# EAGLE schematic bms1ry (EAGLE 4.13)
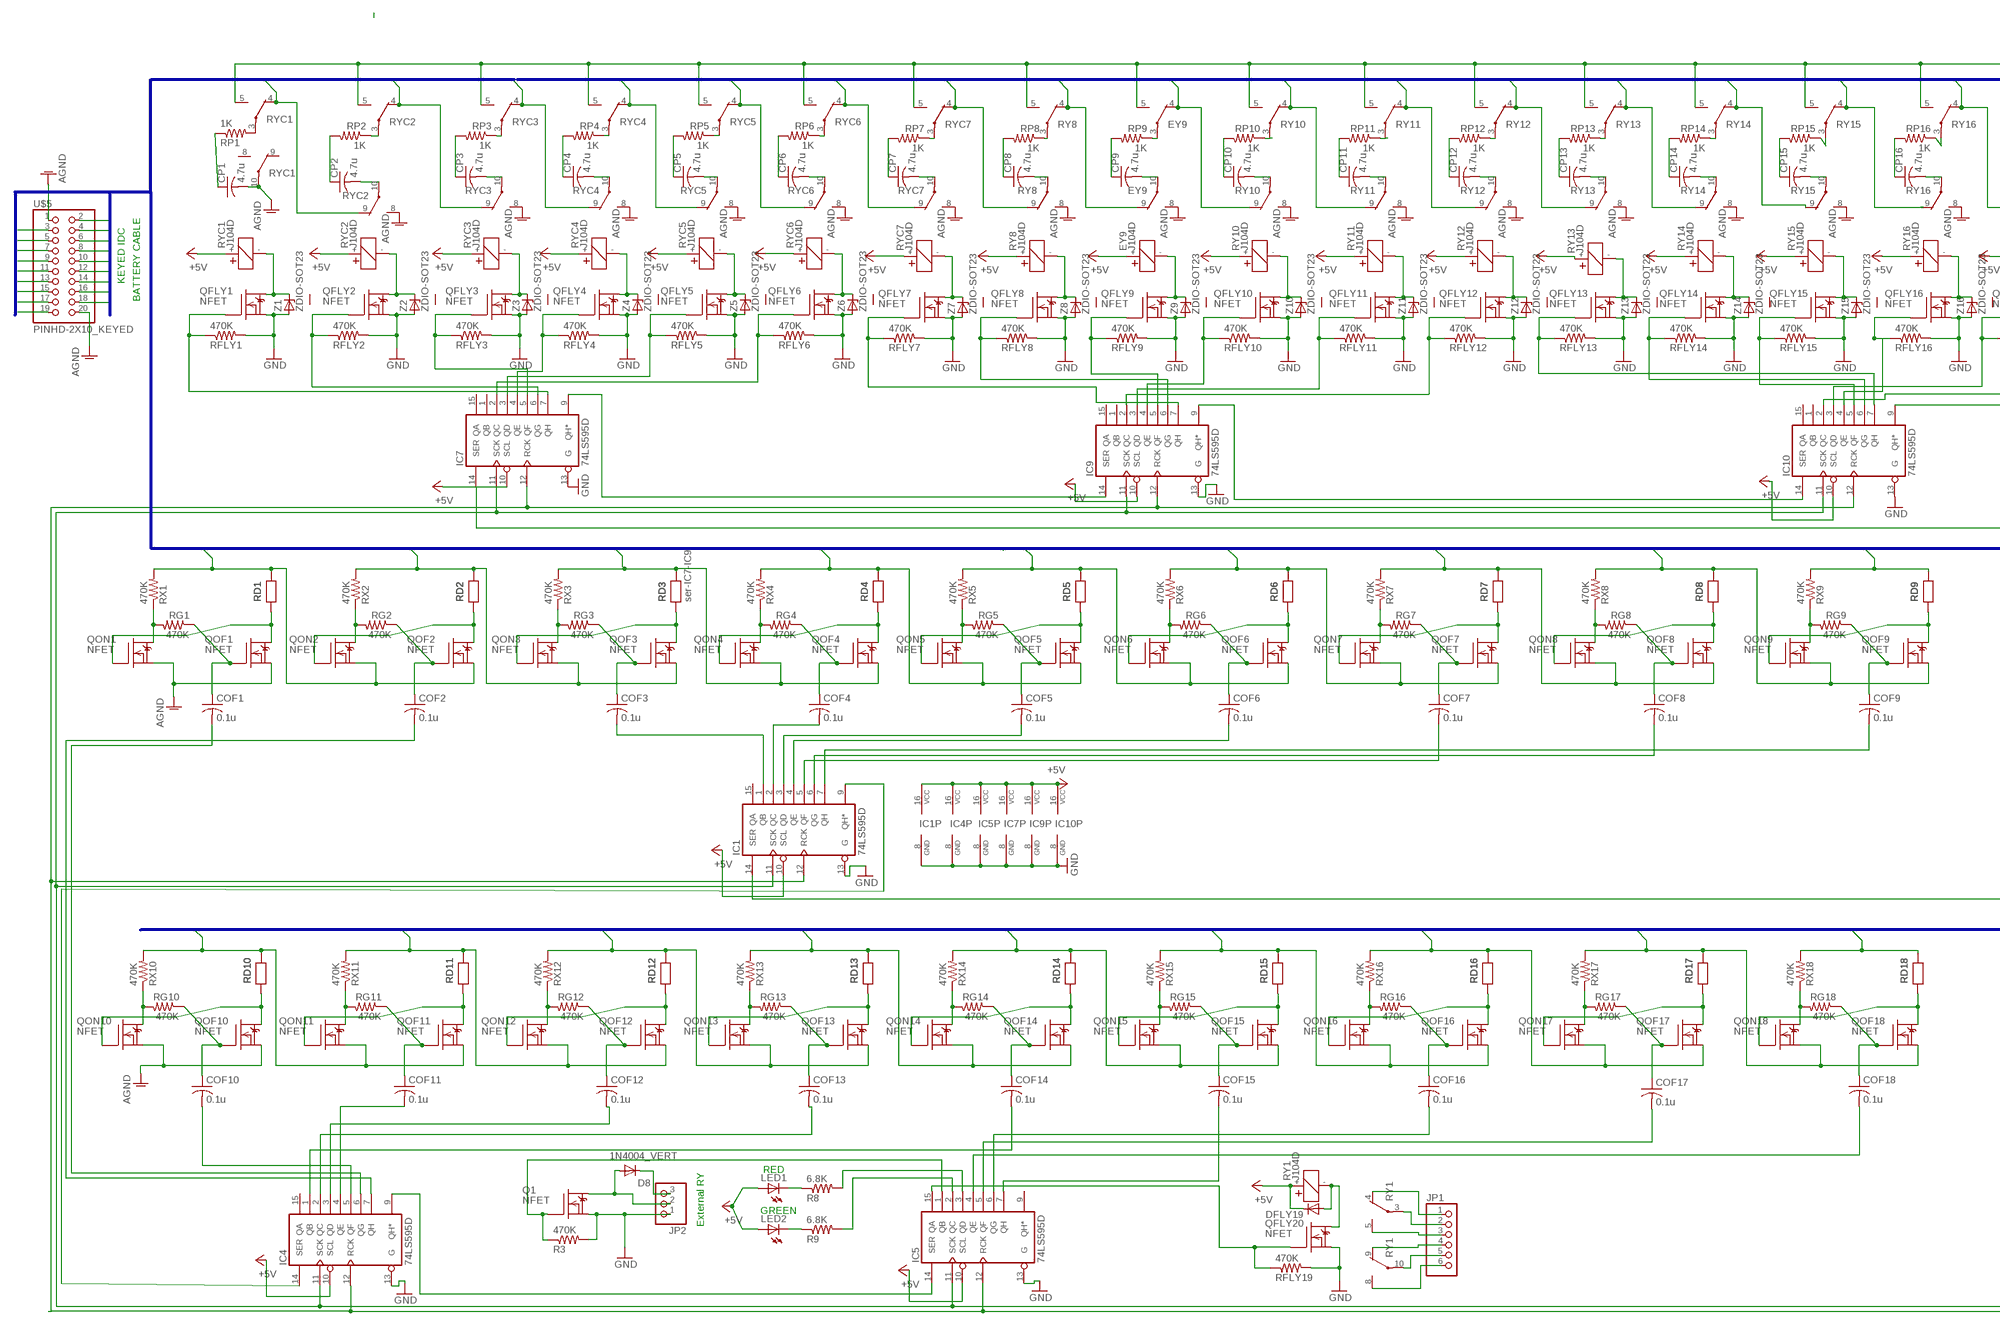
[diagram p0: schematic, sheet 1, part 1 of 2]
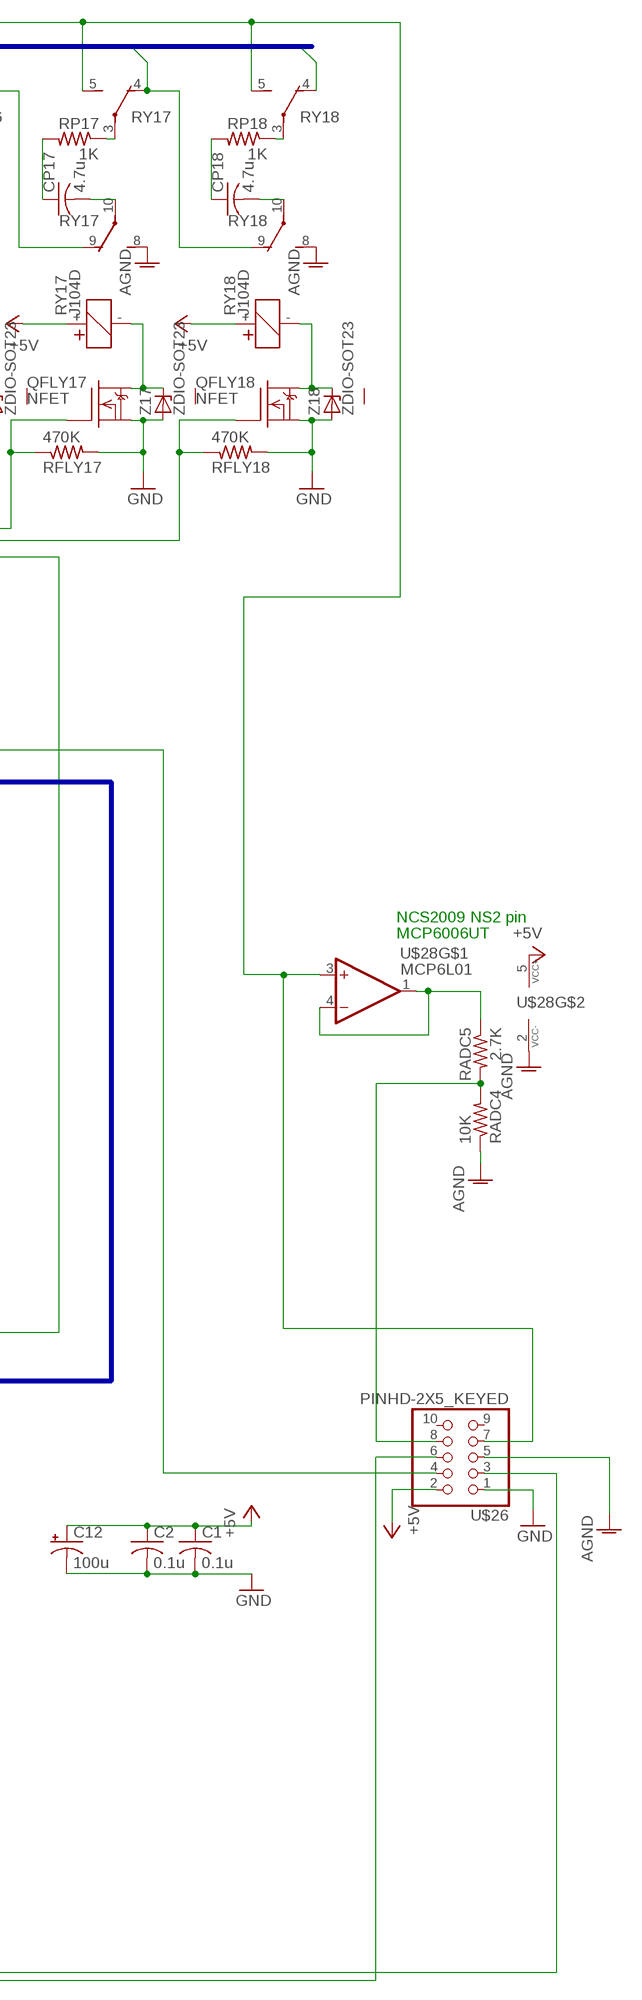
[diagram p1: schematic, sheet 1, part 2 of 2]

## Parts
C1  0.1u  C-USC0603  [C0603]
C2  0.1u  C-USC0603  [C0603]
C12  100u  CPOL-USE5-8.5  [E5-8,5]
COF1  0.1u  C-USC0603  [C0603]
COF2  0.1u  C-USC0603  [C0603]
COF3  0.1u  C-USC0603  [C0603]
COF4  0.1u  C-USC0603  [C0603]
COF5  0.1u  C-USC0603  [C0603]
COF6  0.1u  C-USC0603  [C0603]
COF7  0.1u  C-USC0603  [C0603]
COF8  0.1u  C-USC0603  [C0603]
COF9  0.1u  C-USC0603  [C0603]
COF10  0.1u  C-USC0603  [C0603]
COF11  0.1u  C-USC0603  [C0603]
COF12  0.1u  C-USC0603  [C0603]
COF13  0.1u  C-USC0603  [C0603]
COF14  0.1u  C-USC0603  [C0603]
COF15  0.1u  C-USC0603  [C0603]
COF16  0.1u  C-USC0603  [C0603]
COF17  0.1u  C-USC0603  [C0603]
COF18  0.1u  C-USC0603  [C0603]
CP1  4.7u  C-USC0805  [C0805]
CP2  4.7u  C-USC0805  [C0805]
CP3  4.7u  C-USC0805  [C0805]
CP4  4.7u  C-USC0805  [C0805]
CP5  4.7u  C-USC0805  [C0805]
CP6  4.7u  C-USC0805  [C0805]
CP7  4.7u  C-USC0805  [C0805]
CP8  4.7u  C-USC0805  [C0805]
CP9  4.7u  C-USC0805  [C0805]
CP10  4.7u  C-USC0805  [C0805]
CP11  4.7u  C-USC0805  [C0805]
CP12  4.7u  C-USC0805  [C0805]
CP13  4.7u  C-USC0805  [C0805]
CP14  4.7u  C-USC0805  [C0805]
CP15  4.7u  C-USC0805  [C0805]
CP16  4.7u  C-USC0805  [C0805]
CP17  4.7u  C-USC0805  [C0805]
CP18  4.7u  C-USC0805  [C0805]
D8  1N4004_VERT  [DO41-10_VERT]
DFLY19  DIODE-SOD80C  [SOD80C]
EY9  J104D  [J104D]
IC1  74LS595D  [SO16]
IC4  74LS595D  [SO16]
IC5  74LS595D  [SO16]
IC7  74LS595D  [SO16]
IC9  74LS595D  [SO16]
IC10  74LS595D  [SO16]
JP1  PINHD-1X6  [1X06]
JP2  PINHD-1X3  [1X03]
LED1  LEDCHIP-LED0603  [CHIP-LED0603]
LED2  LEDCHIP-LED0603  [CHIP-LED0603]
Q1  NFET  DMN3404L  [SOT-23]
QFLY1  NFET  DMN3404L  [SOT-23]
QFLY2  NFET  DMN3404L  [SOT-23]
QFLY3  NFET  DMN3404L  [SOT-23]
QFLY4  NFET  DMN3404L  [SOT-23]
QFLY5  NFET  DMN3404L  [SOT-23]
QFLY6  NFET  DMN3404L  [SOT-23]
QFLY7  NFET  DMN3404L  [SOT-23]
QFLY8  NFET  DMN3404L  [SOT-23]
QFLY9  NFET  DMN3404L  [SOT-23]
QFLY10  NFET  DMN3404L  [SOT-23]
QFLY11  NFET  DMN3404L  [SOT-23]
QFLY12  NFET  DMN3404L  [SOT-23]
QFLY13  NFET  DMN3404L  [SOT-23]
QFLY14  NFET  DMN3404L  [SOT-23]
QFLY15  NFET  DMN3404L  [SOT-23]
QFLY16  NFET  DMN3404L  [SOT-23]
QFLY17  NFET  DMN3404L  [SOT-23]
QFLY18  NFET  DMN3404L  [SOT-23]
QFLY20  NFET  DMN3404L  [SOT-23]
QOF1  NFET  DMN3404L  [SOT-23]
QOF2  NFET  DMN3404L  [SOT-23]
QOF3  NFET  DMN3404L  [SOT-23]
QOF4  NFET  DMN3404L  [SOT-23]
QOF5  NFET  DMN3404L  [SOT-23]
QOF6  NFET  DMN3404L  [SOT-23]
QOF7  NFET  DMN3404L  [SOT-23]
QOF8  NFET  DMN3404L  [SOT-23]
QOF9  NFET  DMN3404L  [SOT-23]
QOF10  NFET  DMN3404L  [SOT-23]
QOF11  NFET  DMN3404L  [SOT-23]
QOF12  NFET  DMN3404L  [SOT-23]
QOF13  NFET  DMN3404L  [SOT-23]
QOF14  NFET  DMN3404L  [SOT-23]
QOF15  NFET  DMN3404L  [SOT-23]
QOF16  NFET  DMN3404L  [SOT-23]
QOF17  NFET  DMN3404L  [SOT-23]
QOF18  NFET  DMN3404L  [SOT-23]
QON1  NFET  DMN3404L  [SOT-23]
QON2  NFET  DMN3404L  [SOT-23]
QON3  NFET  DMN3404L  [SOT-23]
QON4  NFET  DMN3404L  [SOT-23]
QON5  NFET  DMN3404L  [SOT-23]
QON6  NFET  DMN3404L  [SOT-23]
QON7  NFET  DMN3404L  [SOT-23]
QON8  NFET  DMN3404L  [SOT-23]
QON9  NFET  DMN3404L  [SOT-23]
QON10  NFET  DMN3404L  [SOT-23]
QON11  NFET  DMN3404L  [SOT-23]
QON12  NFET  DMN3404L  [SOT-23]
QON13  NFET  DMN3404L  [SOT-23]
QON14  NFET  DMN3404L  [SOT-23]
QON15  NFET  DMN3404L  [SOT-23]
QON16  NFET  DMN3404L  [SOT-23]
QON17  NFET  DMN3404L  [SOT-23]
QON18  NFET  DMN3404L  [SOT-23]
R3  470K  R-US_R0603  [R0603]
R8  6.8K  R-US_R0603  [R0603]
R9  6.8K  R-US_R0603  [R0603]
RADC4  10K  R-US_R0603  [R0603]
RADC5  2.7K  R-US_R0603  [R0603]
RD1  RESEU-S2,5  [RS-2,5]
RD2  RESEU-S2,5  [RS-2,5]
RD3  ser-IC7-IC9  RESEU-S2,5  [RS-2,5]
RD4  RESEU-S2,5  [RS-2,5]
RD5  RESEU-S2,5  [RS-2,5]
RD6  RESEU-S2,5  [RS-2,5]
RD7  RESEU-S2,5  [RS-2,5]
RD8  RESEU-S2,5  [RS-2,5]
RD9  RESEU-S2,5  [RS-2,5]
RD10  RESEU-S2,5  [RS-2,5]
RD11  RESEU-S2,5  [RS-2,5]
RD12  RESEU-S2,5  [RS-2,5]
RD13  RESEU-S2,5  [RS-2,5]
RD14  RESEU-S2,5  [RS-2,5]
RD15  RESEU-S2,5  [RS-2,5]
RD16  RESEU-S2,5  [RS-2,5]
RD17  RESEU-S2,5  [RS-2,5]
RD18  RESEU-S2,5  [RS-2,5]
RFLY1  470K  R-US_R0603  [R0603]
RFLY2  470K  R-US_R0603  [R0603]
RFLY3  470K  R-US_R0603  [R0603]
RFLY4  470K  R-US_R0603  [R0603]
RFLY5  470K  R-US_R0603  [R0603]
RFLY6  470K  R-US_R0603  [R0603]
RFLY7  470K  R-US_R0603  [R0603]
RFLY8  470K  R-US_R0603  [R0603]
RFLY9  470K  R-US_R0603  [R0603]
RFLY10  470K  R-US_R0603  [R0603]
RFLY11  470K  R-US_R0603  [R0603]
RFLY12  470K  R-US_R0603  [R0603]
RFLY13  470K  R-US_R0603  [R0603]
RFLY14  470K  R-US_R0603  [R0603]
RFLY15  470K  R-US_R0603  [R0603]
RFLY16  470K  R-US_R0603  [R0603]
RFLY17  470K  R-US_R0603  [R0603]
RFLY18  470K  R-US_R0603  [R0603]
RFLY19  470K  R-US_R0603  [R0603]
RG1  470K  R-US_R0603  [R0603]
RG2  470K  R-US_R0603  [R0603]
RG3  470K  R-US_R0603  [R0603]
RG4  470K  R-US_R0603  [R0603]
RG5  470K  R-US_R0603  [R0603]
RG6  470K  R-US_R0603  [R0603]
RG7  470K  R-US_R0603  [R0603]
RG8  470K  R-US_R0603  [R0603]
RG9  470K  R-US_R0603  [R0603]
RG10  470K  R-US_R0603  [R0603]
RG11  470K  R-US_R0603  [R0603]
RG12  470K  R-US_R0603  [R0603]
RG13  470K  R-US_R0603  [R0603]
RG14  470K  R-US_R0603  [R0603]
RG15  470K  R-US_R0603  [R0603]
RG16  470K  R-US_R0603  [R0603]
RG17  470K  R-US_R0603  [R0603]
RG18  470K  R-US_R0603  [R0603]
RP1  1K  R-US_R0603  [R0603]
RP2  1K  R-US_R0603  [R0603]
RP3  1K  R-US_R0603  [R0603]
RP4  1K  R-US_R0603  [R0603]
RP5  1K  R-US_R0603  [R0603]
RP6  1K  R-US_R0603  [R0603]
RP7  1K  R-US_R0603  [R0603]
RP8  1K  R-US_R0603  [R0603]
RP9  1K  R-US_R0603  [R0603]
RP10  1K  R-US_R0603  [R0603]
RP11  1K  R-US_R0603  [R0603]
RP12  1K  R-US_R0603  [R0603]
RP13  1K  R-US_R0603  [R0603]
RP14  1K  R-US_R0603  [R0603]
RP15  1K  R-US_R0603  [R0603]
RP16  1K  R-US_R0603  [R0603]
RP17  1K  R-US_R0603  [R0603]
RP18  1K  R-US_R0603  [R0603]
RX1  470K  R-US_R0603  [R0603]
RX2  470K  R-US_R0603  [R0603]
RX3  470K  R-US_R0603  [R0603]
RX4  470K  R-US_R0603  [R0603]
RX5  470K  R-US_R0603  [R0603]
RX6  470K  R-US_R0603  [R0603]
RX7  470K  R-US_R0603  [R0603]
RX8  470K  R-US_R0603  [R0603]
RX9  470K  R-US_R0603  [R0603]
RX10  470K  R-US_R0603  [R0603]
RX11  470K  R-US_R0603  [R0603]
RX12  470K  R-US_R0603  [R0603]
RX13  470K  R-US_R0603  [R0603]
RX14  470K  R-US_R0603  [R0603]
RX15  470K  R-US_R0603  [R0603]
RX16  470K  R-US_R0603  [R0603]
RX17  470K  R-US_R0603  [R0603]
RX18  470K  R-US_R0603  [R0603]
RY1  J104D  [J104D]
RY8  J104D  [J104D]
RY10  J104D  [J104D]
RY11  J104D  [J104D]
RY12  J104D  [J104D]
RY13  J104D  [J104D]
RY14  J104D  [J104D]
RY15  J104D  [J104D]
RY16  J104D  [J104D]
RY17  J104D  [J104D]
RY18  J104D  [J104D]
RYC1  J104D  [J104D]
RYC2  J104D  [J104D]
RYC3  J104D  [J104D]
RYC4  J104D  [J104D]
RYC5  J104D  [J104D]
RYC6  J104D  [J104D]
RYC7  J104D  [J104D]
U$5  PINHD-2X10_KEYED  [2X10_KEYED]
U$26  PINHD-2X5_KEYED  [2X05_KEYED]
U$28  MCP6L01  [SOT23-5]
Z1  ZDIO-SOT23  [SOT-23]
Z2  ZDIO-SOT23  [SOT-23]
Z3  ZDIO-SOT23  [SOT-23]
Z4  ZDIO-SOT23  [SOT-23]
Z5  ZDIO-SOT23  [SOT-23]
Z6  ZDIO-SOT23  [SOT-23]
Z7  ZDIO-SOT23  [SOT-23]
Z8  ZDIO-SOT23  [SOT-23]
Z9  ZDIO-SOT23  [SOT-23]
Z10  ZDIO-SOT23  [SOT-23]
Z11  ZDIO-SOT23  [SOT-23]
Z12  ZDIO-SOT23  [SOT-23]
Z13  ZDIO-SOT23  [SOT-23]
Z14  ZDIO-SOT23  [SOT-23]
Z15  ZDIO-SOT23  [SOT-23]
Z16  ZDIO-SOT23  [SOT-23]
Z17  ZDIO-SOT23  [SOT-23]
Z18  ZDIO-SOT23  [SOT-23]

## Nets
+5V: C1.1 C2.1 C12.+ DFLY19.C EY9.+ IC1.10(SCL) IC1.16(VCC) IC4.10(SCL) IC4.16(VCC) IC5.10(SCL) IC5.16(VCC) IC7.10(SCL) IC7.16(VCC) IC9.10(SCL) IC9.16(VCC) IC10.10(SCL) IC10.16(VCC) LED1.A LED2.A RY1.+ RY8.+ RY10.+ RY11.+ RY12.+ RY13.+ RY14.+ RY15.+ RY16.+ RY17.+ RY18.+ RYC1.+ RYC2.+ RYC3.+ RYC4.+ RYC5.+ RYC6.+ RYC7.+ U$26.2 U$28.5(VCC+)
AGND: CP1.2 EY9.8(S) QOF1.2(S) QOF10.2(S) QON1.2(S) QON10.2(S) RADC4.1 RY8.8(S) RY10.8(S) RY11.8(S) RY12.8(S) RY13.8(S) RY14.8(S) RY15.8(S) RY16.8(S) RY17.8(S) RY18.8(S) RYC1.10(P) RYC2.8(S) RYC3.8(S) RYC4.8(S) RYC5.8(S) RYC6.8(S) RYC7.8(S) U$5.1 U$5.20 U$26.5 U$28.2(VCC-)
C1: QOF2.2(S) QON2.2(S) RD1.2 RX1.2 RYC1.4(O) RYC2.9(O) U$5.11
C2: QOF3.2(S) QON3.2(S) RD2.2 RX2.2 RYC2.4(O) RYC3.9(O) U$5.2
C3: QOF4.2(S) QON4.2(S) RD3.2 RX3.2 RYC3.4(O) RYC4.9(O) U$5.12
C4: QOF5.2(S) QON5.2(S) RD4.2 RX4.2 RYC4.4(O) RYC5.9(O) U$5.3
C5: QOF6.2(S) QON6.2(S) RD5.2 RX5.2 RYC5.4(O) RYC6.9(O) U$5.13
C6: QOF7.2(S) QON7.2(S) RD6.2 RX6.2 RYC6.4(O) RYC7.9(O) U$5.4
C7: QOF8.2(S) QON8.2(S) RD7.2 RX7.2 RY8.9(O) RYC7.4(O) U$5.14
C8: EY9.9(O) QOF9.2(S) QON9.2(S) RD8.2 RX8.2 RY8.4(O) U$5.5
C9: EY9.4(O) RD9.2 RX9.2 RY10.9(O) U$5.15
C10: QOF11.2(S) QON11.2(S) RD10.2 RX10.2 RY10.4(O) RY11.9(O) U$5.6
C11: QOF12.2(S) QON12.2(S) RD11.2 RX11.2 RY11.4(O) RY12.9(O) U$5.16
C12: QOF13.2(S) QON13.2(S) RD12.2 RX12.2 RY12.4(O) RY13.9(O) U$5.7
C13: QOF14.2(S) QON14.2(S) RD13.2 RX13.2 RY13.4(O) RY14.9(O) U$5.17
C14: QOF15.2(S) QON15.2(S) RD14.2 RX14.2 RY14.4(O) RY15.9(O) U$5.8
C15: QOF16.2(S) QON16.2(S) RD15.2 RX15.2 RY15.4(O) RY16.9(O) U$5.18
C16: QOF17.2(S) QON17.2(S) RD16.2 RX16.2 RY16.4(O) RY17.9(O) U$5.9
C17: QOF18.2(S) QON18.2(S) RD17.2 RX17.2 RY17.4(O) RY18.9(O) U$5.19
C18: RD18.2 RX18.2 RY18.4(O) U$5.10
FLYCAP-COMMON: EY9.5(S) RY8.5(S) RY10.5(S) RY11.5(S) RY12.5(S) RY13.5(S) RY14.5(S) RY15.5(S) RY16.5(S) RY17.5(S) RY18.5(S) RYC1.5(S) RYC2.5(S) RYC3.5(S) RYC4.5(S) RYC5.5(S) RYC6.5(S) RYC7.5(S) U$26.7 U$28.3(+IN)
FLYCAP-OPAMP-OUT: RADC4.2 RADC5.2 U$26.8
GND: C1.2 C2.2 C12.- IC1.8(GND) IC1.13(G) IC4.8(GND) IC4.13(G) IC5.8(GND) IC5.13(G) IC7.8(GND) IC7.13(G) IC9.8(GND) IC9.13(G) IC10.8(GND) IC10.13(G) JP2.1 Q1.2(S) QFLY1.2(S) QFLY2.2(S) QFLY3.2(S) QFLY4.2(S) QFLY5.2(S) QFLY6.2(S) QFLY7.2(S) QFLY8.2(S) QFLY9.2(S) QFLY10.2(S) QFLY11.2(S) QFLY12.2(S) QFLY13.2(S) QFLY14.2(S) QFLY15.2(S) QFLY16.2(S) QFLY17.2(S) QFLY18.2(S) QFLY20.2(S) R3.2 RFLY1.2 RFLY2.2 RFLY3.2 RFLY4.2 RFLY5.2 RFLY6.2 RFLY7.2 RFLY8.2 RFLY9.2 RFLY10.2 RFLY11.2 RFLY12.2 RFLY13.2 RFLY14.2 RFLY15.2 RFLY16.2 RFLY17.2 RFLY18.2 RFLY19.2 U$26.1 Z1.1(A) Z2.1(A) Z3.1(A) Z4.1(A) Z5.1(A) Z6.1(A) Z7.1(A) Z8.1(A) Z9.1(A) Z10.1(A) Z11.1(A) Z12.1(A) Z13.1(A) Z14.1(A) Z15.1(A) Z16.1(A) Z17.1(A) Z18.1(A)
MOSI-FROM-PROC: IC7.14(SER) U$26.4
N$2: IC7.6(QG) QFLY2.1(G) RFLY2.1
N$3: RP2.1 RYC2.3(P)
N$4: D8.A JP2.2 Q1.3(D)
N$5: D8.C JP2.3
N$6: IC5.15(QA) QFLY20.1(G) RFLY19.1
N$7: LED2.C R9.1
N$8: CP15.2 RY15.10(P)
N$9: CP2.2 RYC2.10(P)
N$10: LED1.C R8.1
N$11: IC7.5(QF) QFLY3.1(G) RFLY3.1
N$12: IC7.7(QH) QFLY1.1(G) RFLY1.1
N$13: IC7.4(QE) QFLY4.1(G) RFLY4.1
N$14: IC7.3(QD) QFLY5.1(G) RFLY5.1
N$16: IC7.2(QC) QFLY6.1(G) RFLY6.1
N$17: RADC5.1 U$28.1(OUT) U$28.4(-IN)
N$18: COF3.2 IC1.1(QB)
N$19: IC9.6(QG) QFLY8.1(G) RFLY8.1
N$20: COF4.2 IC1.2(QC)
N$21: COF5.2 IC1.3(QD)
N$22: IC9.2(QC) QFLY12.1(G) RFLY12.1
N$23: IC10.7(QH) QFLY13.1(G) RFLY13.1
N$24: IC10.6(QG) QFLY14.1(G) RFLY14.1
N$25: IC10.5(QF) QFLY15.1(G) RFLY15.1
N$26: IC10.4(QE) QFLY16.1(G) RFLY16.1
N$27: IC10.3(QD) QFLY17.1(G) RFLY17.1
N$28: IC10.2(QC) QFLY18.1(G) RFLY18.1
N$29: RP3.1 RYC3.3(P)
N$30: CP4.2 RYC4.10(P)
N$31: RP1.2 RYC1.3(P)
N$32: COF6.2 IC1.4(QE)
N$33: CP2.1 RP2.2
N$34: CP3.2 RYC3.10(P)
N$35: CP5.2 RYC5.10(P)
N$36: CP6.2 RYC6.10(P)
N$38: CP7.2 RYC7.10(P)
N$39: CP8.2 RY8.10(P)
N$40: CP10.2 RY10.10(P)
N$41: CP11.2 RY11.10(P)
N$42: CP12.2 RY12.10(P)
N$43: CP13.2 RY13.10(P)
N$44: CP14.2 RY14.10(P)
N$45: CP16.2 RY16.10(P)
N$46: CP17.2 RY17.10(P)
N$47: CP15.1 RP15.2
N$48: CP18.2 RY18.10(P)
N$49: RP4.1 RYC4.3(P)
N$50: RP5.1 RYC5.3(P)
N$51: RP6.1 RYC6.3(P)
N$52: RP7.1 RYC7.3(P)
N$53: RP8.1 RY8.3(P)
N$54: EY9.3(P) RP9.1
N$55: RP10.1 RY10.3(P)
N$56: RP11.1 RY11.3(P)
N$57: RP12.1 RY12.3(P)
N$58: RP13.1 RY13.3(P)
N$59: RP14.1 RY14.3(P)
N$60: RP15.1 RY15.3(P)
N$61: RP16.1 RY16.3(P)
N$62: RP17.1 RY17.3(P)
N$63: RP18.1 RY18.3(P)
N$64: JP1.2 RY1.3(P)
N$65: JP1.1 RY1.4(O)
N$66: COF7.2 IC1.5(QF)
N$67: COF8.2 IC1.6(QG)
N$68: COF9.2 IC1.7(QH)
N$69: COF1.1 QOF1.1(G) RG1.1
N$70: QOF1.3(D) QON1.1(G) RD1.1
N$71: QON1.3(D) RG1.2 RX1.1
N$72: QON2.3(D) RG2.2 RX2.1
N$73: QON3.3(D) RG3.2 RX3.1
N$74: COF2.1 QOF2.1(G) RG2.1
N$75: QOF2.3(D) QON2.1(G) RD2.1
N$77: QON4.3(D) RG4.2 RX4.1
N$78: QON5.3(D) RG5.2 RX5.1
N$79: QON6.3(D) RG6.2 RX6.1
N$80: COF3.1 QOF3.1(G) RG3.1
N$81: QOF3.3(D) QON3.1(G) RD3.1
N$82: QON7.3(D) RG7.2 RX7.1
N$83: QON8.3(D) RG8.2 RX8.1
N$84: QON9.3(D) RG9.2 RX9.1
N$85: QON10.3(D) RG10.2 RX10.1
N$86: COF4.1 QOF4.1(G) RG4.1
N$87: QOF4.3(D) QON4.1(G) RD4.1
N$88: COF5.1 QOF5.1(G) RG5.1
N$89: QOF5.3(D) QON5.1(G) RD5.1
N$90: QON11.3(D) RG11.2 RX11.1
N$91: QON12.3(D) RG12.2 RX12.1
N$92: QON13.3(D) RG13.2 RX13.1
N$93: QON14.3(D) RG14.2 RX14.1
N$94: QON15.3(D) RG15.2 RX15.1
N$95: QON16.3(D) RG16.2 RX16.1
N$96: QON17.3(D) RG17.2 RX17.1
N$97: QON18.3(D) RG18.2 RX18.1
N$98: COF2.2 IC4.7(QH)
N$99: COF1.2 IC4.6(QG)
N$100: COF10.2 IC4.5(QF)
N$101: COF11.2 IC4.4(QE)
N$102: COF12.2 IC4.3(QD)
N$103: COF13.2 IC4.2(QC)
N$105: CP16.1 RP16.2
N$106: CP1.1 RP1.1
N$107: CP3.1 RP3.2
N$108: CP9.2 EY9.10(P)
N$109: CP4.1 RP4.2
N$110: CP5.1 RP5.2
N$111: CP6.1 RP6.2
N$112: CP10.1 RP10.2
N$113: CP7.1 RP7.2
N$114: CP8.1 RP8.2
N$115: CP9.1 RP9.2
N$116: CP11.1 RP11.2
N$117: CP12.1 RP12.2
N$118: CP13.1 RP13.2
N$119: CP14.1 RP14.2
N$120: CP17.1 RP17.2
N$121: CP18.1 RP18.2
N$122: COF14.2 IC4.1(QB)
N$123: COF15.2 IC5.7(QH)
N$124: COF16.2 IC5.6(QG)
N$125: COF17.2 IC5.5(QF)
N$126: COF6.1 QOF6.1(G) RG6.1
N$127: QOF6.3(D) QON6.1(G) RD6.1
N$128: COF18.2 IC5.4(QE)
N$129: IC5.3(QD) R8.2
N$130: IC5.2(QC) R9.2
N$131: IC7.9(QH*) IC9.14(SER)
N$132: COF7.1 QOF7.1(G) RG7.1
N$133: QOF7.3(D) QON7.1(G) RD7.1
N$134: JP1.3 RY1.5(S)
N$135: JP1.4 RY1.9(O)
N$136: JP1.5 RY1.10(P)
N$137: JP1.6 RY1.8(S)
N$138: COF8.1 QOF8.1(G) RG8.1
N$139: QOF8.3(D) QON8.1(G) RD8.1
N$144: COF9.1 QOF9.1(G) RG9.1
N$145: QOF9.3(D) QON9.1(G) RD9.1
N$150: COF10.1 QOF10.1(G) RG10.1
N$151: QOF10.3(D) QON10.1(G) RD10.1
N$154: COF11.1 QOF11.1(G) RG11.1
N$155: QOF11.3(D) QON11.1(G) RD11.1
N$158: COF12.1 QOF12.1(G) RG12.1
N$159: QOF12.3(D) QON12.1(G) RD12.1
N$162: COF13.1 QOF13.1(G) RG13.1
N$163: QOF13.3(D) QON13.1(G) RD13.1
N$174: COF14.1 QOF14.1(G) RG14.1
N$175: QOF14.3(D) QON14.1(G) RD14.1
N$179: COF15.1 QOF15.1(G) RG15.1
N$180: QOF15.3(D) QON15.1(G) RD15.1
N$184: COF16.1 QOF16.1(G) RG16.1
N$185: QOF16.3(D) QON16.1(G) RD16.1
N$189: COF17.1 QOF17.1(G) RG17.1
N$190: QOF17.3(D) QON17.1(G) RD17.1
N$194: COF18.1 QOF18.1(G) RG18.1
N$195: QOF18.3(D) QON18.1(G) RD18.1
N$204: IC9.3(QD) QFLY11.1(G) RFLY11.1
N$205: IC9.5(QF) QFLY9.1(G) RFLY9.1
N$206: IC9.4(QE) QFLY10.1(G) RFLY10.1
N$208: IC9.7(QH) QFLY7.1(G) RFLY7.1
NSS-RCLK: IC1.12(RCK) IC4.12(RCK) IC5.12(RCK) IC7.12(RCK) IC9.12(RCK) IC10.12(RCK) U$26.6
PC8-FETGATE-CHGR-RELAY: IC5.1(QB) Q1.1(G) R3.1
QDFLY1: QFLY1.3(D) RYC1.- Z1.3(C)
QDFLY2: QFLY2.3(D) RYC2.- Z2.3(C)
QDFLY3: QFLY3.3(D) RYC3.- Z3.3(C)
QDFLY4: QFLY4.3(D) RYC4.- Z4.3(C)
QDFLY5: QFLY5.3(D) RYC5.- Z5.3(C)
QDFLY6: QFLY6.3(D) RYC6.- Z6.3(C)
QDFLY7: QFLY7.3(D) RYC7.- Z7.3(C)
QDFLY8: QFLY8.3(D) RY8.- Z8.3(C)
QDFLY9: EY9.- QFLY9.3(D) Z9.3(C)
QDFLY10: QFLY10.3(D) RY10.- Z10.3(C)
QDFLY11: QFLY11.3(D) RY11.- Z11.3(C)
QDFLY12: QFLY12.3(D) RY12.- Z12.3(C)
QDFLY13: QFLY13.3(D) RY13.- Z13.3(C)
QDFLY14: QFLY14.3(D) RY14.- Z14.3(C)
QDFLY15: QFLY15.3(D) RY15.- Z15.3(C)
QDFLY16: QFLY16.3(D) RY16.- Z16.3(C)
QDFLY17: QFLY17.3(D) RY17.- Z17.3(C)
QDFLY18: QFLY18.3(D) RY18.- Z18.3(C)
QDFLY19: DFLY19.A QFLY20.3(D) RY1.-
SCK: IC1.11(SCK) IC4.11(SCK) IC5.11(SCK) IC7.11(SCK) IC9.11(SCK) IC10.11(SCK) U$26.3
SER-IC1-IC4: IC1.9(QH*) IC4.14(SER)
SER-IC4-IC5: IC4.9(QH*) IC5.14(SER)
SER-IC9-IC10: IC9.9(QH*) IC10.14(SER)
SER-IC10-IC1: IC1.14(SER) IC10.9(QH*)
Unconnected: IC1.15(QA) IC4.15(QA) IC5.9(QH*) IC7.1(QB) IC7.15(QA) IC9.1(QB) IC9.15(QA) IC10.1(QB) IC10.15(QA) RYC1.8(S) RYC1.9(O) U$26.9 U$26.10 Z1.2(NC) Z2.2(NC) Z3.2(NC) Z4.2(NC) Z5.2(NC) Z6.2(NC) Z7.2(NC) Z8.2(NC) Z9.2(NC) Z10.2(NC) Z11.2(NC) Z12.2(NC) Z13.2(NC) Z14.2(NC) Z15.2(NC) Z16.2(NC) Z17.2(NC) Z18.2(NC)

## Buses
C$1:C[0..18]

## Notes on the sheet
- BATTERY CABLE
- KEYED IDC
- NCS2009 NS2 pin
- MCP6006UT
- RED
- GREEN
- External RY

## Library data of the parts
C1 C2 COF1-COF18 CP1-CP18 = rcl:C-US: CAPACITOR, American symbol
C12 = rcl:CPOL-US: POLARIZED CAPACITOR, American symbol
D8 = diode:1N4004_VERT
DFLY19 = diode-1:DIODE-: DIODE
EY9 RY1 RY8 RY10-RY18 RYC1-RYC7 = relay:J104D
IC1 IC4 IC5 IC7 IC9 IC10 = 74xx-us:74*595: 8-bit SHIFT REGISTER, output latch
JP1 = pinhead:PINHD-1X6: PIN HEADER
JP2 = pinhead:PINHD-1X3: PIN HEADER
LED1 LED2 = led:LED: LED OSRAM: - CHIPLED LG R971, LG N971, LY N971, LG Q971, LY Q971, LO R971, LY R971 LH N974, LH R974 LS Q976, LO Q976, LY Q976 LO Q996 - Hyper CHIPLED LW Q18S LB Q993, LB Q99A, LB R99A - SideLED LS A670, LO A670, LY A670, LG A670, LP A670 LB A673, LV A673, LT A673, LW A673 LH A674 LY A675 LS A676, LA A676, LO A676, LY A676, LW A676 LS A679, LY A679, LG A679 - Hyper Micro SIDELED® LS Y876, LA Y876, LO Y876, LY Y876 LT Y87S - SmartLED LW L88C, LW L88S LB L89C, LB L89S, LG L890 LS L89K, LO L89K, LY L89K LS L896, LA L896, LO L896, LY L896 - TOPLED LS T670, LO T670, LY T670, LG T670, LP T670 LSG T670, LSP T670, LSY T670, LOP T670, LYG T670 LG T671, LOG T671, LSG T671 LB T673, LV T673, LT T673, LW T673 LH T674 LS T676, LA T676, LO T676, LY T676, LB T676, LH T676, LSB T676, LW T676 LB T67C, LV T67C, LT T67C, LS T67K, LO T67K, LY T67K, LW E67C LS E67B, LA E67B, LO E67B, LY E67B, LB E67C, LV E67C, LT E67C LW T67C LS T679, LY T679, LG T679 LS T770, LO T770, LY T770, LG T770, LP T770 LB T773, LV T773, LT T773, LW T773 LH T774 LS E675, LA E675, LY E675, LS T675 LS T776, LA T776, LO T776, LY T776, LB T776 LHGB T686 LT T68C, LB T68C - Hyper Mini TOPLED® LB M676 - Mini TOPLED Santana® LG M470 LS M47K, LO M47K, LY M47K Source: http://www.osram.convergy.de/
Q1 QFLY1-QFLY18 QFLY20 QOF1-QOF18 QON1-QON18 = transistor-fet:DMN3404L
R3 R8 R9 RADC4 RADC5 RFLY1-RFLY19 RG1-RG18 RP1-RP18 RX1-RX18 = rcl:R-US_: RESISTOR, American symbol
RD1-RD18 = DEH:RESEU-S2,5
U$5 = pinhead:PINHD-2X10_KEYED
U$26 = pinhead:PINHD-2X5_KEYED
U$28 = op-amp:MCP6L01
Z1-Z18 = DEH:ZDIO-SOT23